# Altium schematic sheet WAVE_RESHAPE.SchDoc
size C; SheetNumber: 1; SheetTotal: 1
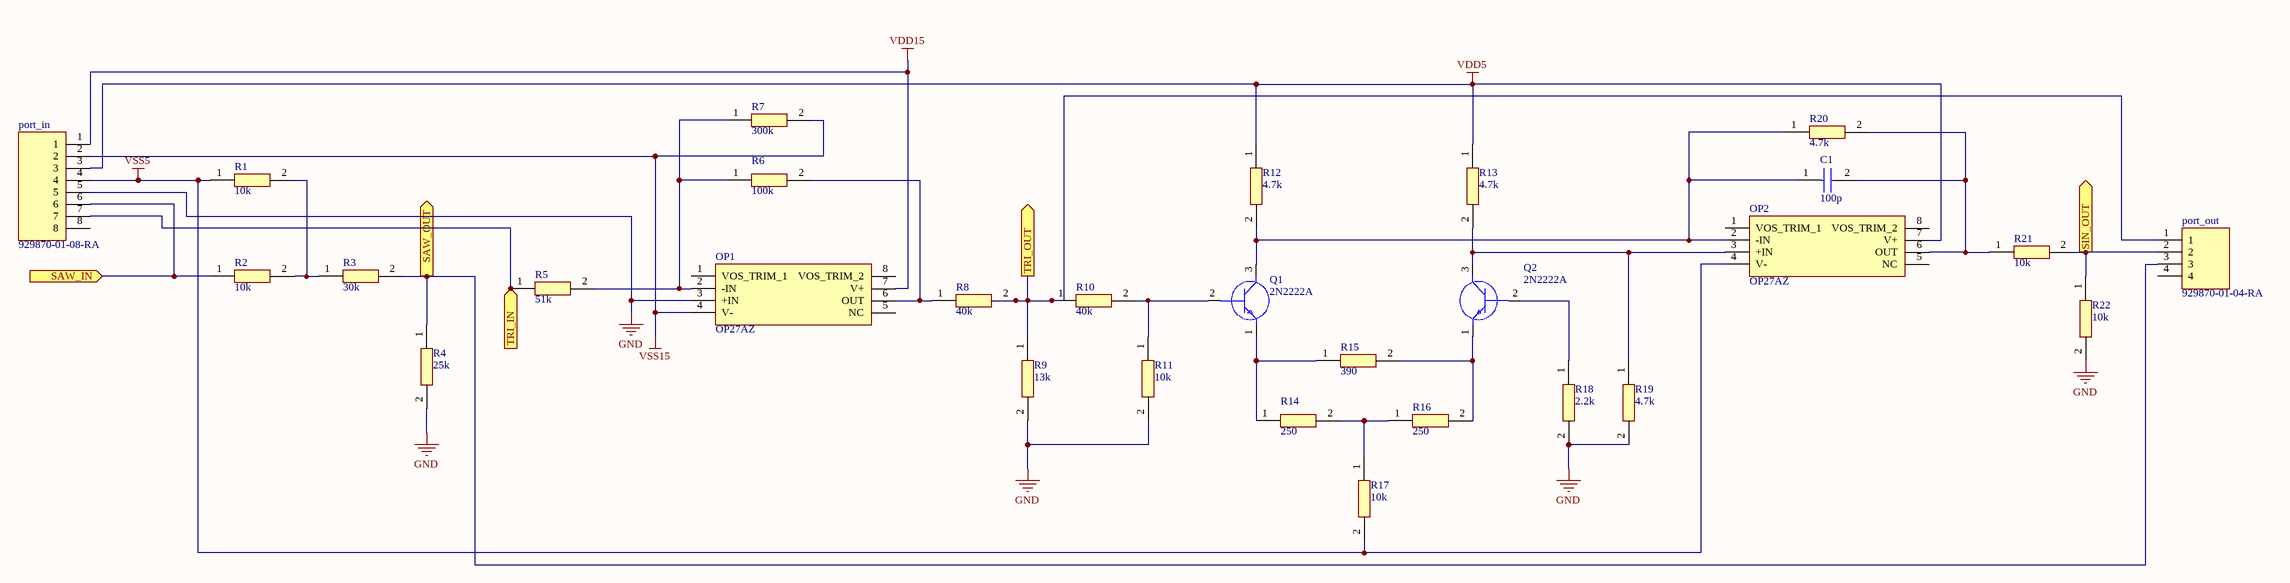
[diagram p0: WAVE_RESHAPE.SchDoc]

## Parts
C1  100p  [CAPPA2400W30L800D400]
OP1  OP27AZ  [DIP775W58P254L1029H508Q8N]
OP2  OP27AZ  [DIP775W58P254L1029H508Q8N]
port_in  929870-01-08-RA  [929870-01-08-RA]
port_out  929870-01-04-RA  [RHDR4W76P0X254_1X4_1016X254X826P]
Q1  2N2222A  [CENTRAL_TO18]
Q2  2N2222A  [CENTRAL_TO18]
R1  10k  [RESAD1650W60L650D250]
R2  10k  [RESAD1650W60L650D250]
R3  30k  [RESAD1650W60L650D250]
R4  25k  [RESAD1650W60L650D250]
R5  51k  [RESAD1650W60L650D250]
R6  100k  [RESAD1650W60L650D250]
R7  300k  [RESAD1650W60L650D250]
R8  40k  [RESAD1650W60L650D250]
R9  13k  [RESAD1650W60L650D250]
R10  40k  [RESAD1650W60L650D250]
R11  10k  [RESAD1650W60L650D250]
R12  4.7k  [RESAD1650W60L650D250]
R13  4.7k  [RESAD1650W60L650D250]
R14  250  [RESAD1650W60L650D250]
R15  390  [RESAD1650W60L650D250]
R16  250  [RESAD1650W60L650D250]
R17  10k  [RESAD1650W60L650D250]
R18  2.2k  [RESAD1650W60L650D250]
R19  4.7k  [RESAD1650W60L650D250]
R20  4.7k  [RESAD1650W60L650D250]
R21  10k  [RESAD1650W60L650D250]
R22  10k  [RESAD1650W60L650D250]

## Ports
SAW_IN (in), SAW_OUT (out), SIN_OUT (out), TRI_IN (in), TRI_OUT (out)

## Nets
GND: OP1.3(+IN) port_in.5 R4.2 R9.2 R11.2 R18.2 R19.2 R22.2
VDD5: OP2.7(V+) port_in.3 R12.1 R13.1
VDD15: OP1.7(V+) port_in.1
VSS5: OP2.4(V-) port_in.4 R1.1 R17.2
VSS15: OP1.4(V-) port_in.2 R7.2
SAW_IN: port_in.6 R2.1 ; port SAW_IN
SAW_OUT: port_out.3 R3.2 R4.1 ; port SAW_OUT
SIN_OUT: port_out.2 R21.2 R22.1 ; port SIN_OUT
TRI_IN: port_in.7 R5.1 ; port TRI_IN
TRI_OUT: port_out.1 R8.2 R9.1 R10.1 ; port TRI_OUT
NetC1_1: C1.1(+) OP2.2(-IN) Q1.3(C) R12.2 R20.1
NetC1_2: C1.2(-) OP2.6(OUT) R20.2 R21.1
NetOP1_2: OP1.2(-IN) R5.2 R6.1 R7.1
NetOP1_6: OP1.6(OUT) R6.2 R8.1
NetOP2_3: OP2.3(+IN) Q2.3(C) R13.2 R19.1
NetQ1_1: Q1.1(E) R14.1 R15.1
NetQ1_2: Q1.2(B) R10.2 R11.1
NetQ2_1: Q2.1(E) R15.2 R16.2
NetQ2_2: Q2.2(B) R18.1
NetR1_2: R1.2 R2.2 R3.1
NetR14_2: R14.2 R16.1 R17.1

Not connected (* = marked no-connect by the designer): OP1 1(VOS_TRIM_1) 5(NC) 8(VOS_TRIM_2); OP2 1(VOS_TRIM_1) 5(NC) 8(VOS_TRIM_2); port_in 8; port_out 4

## Library data of the parts
C1 = 0113207: Capacitor; Manufacturer_Name: RS Pro; Datasheet Link: https://docs.rs-online.com/d68c/0900766b8157e121.pdf; Manufacturer_Part_Number: 0113207
OP1 OP2 = OP27AZ: Integrated Circuit; Manufacturer_Name: Analog Devices; Datasheet Link: https://www.analog.com/media/en/technical-documentation/data-sheets/OP27.pdf; Height: 5.08mm; Manufacturer_Part_Number: OP27AZ; Mouser Part Number: 700-OP27AZNR; Mouser Price/Stock: https://www.mouser.co.uk/ProductDetail/Maxim-Integrated/OP27AZ?qs=7RslVrYcaDTFV9h3XrpsTA%3D%3D; Arrow Part Number: OP27AZ; Arrow Price/Stock: https://www.arrow.com/en/products/op27az/analog-devices
port_in = 929870-01-08-RA: Connector; Manufacturer_Name: 3M; Datasheet Link: https://componentsearchengine.com/Datasheets/2/929870-01-08-RA.pdf; Height: 3.8mm; Manufacturer_Part_Number: 929870-01-08-RA; Mouser Part Number: 517-929870-01-08-RA; Mouser Price/Stock: https://www.mouser.co.uk/ProductDetail/3M-Electronic-Solutions-Division/929870-01-08-RA?qs=neFkstNq%252B6FsuK7vJEiMKg%3D%3D; Arrow Part Number: 929870-01-08-RA; Arrow Price/Stock: https://www.arrow.com/en/products/929870-01-08-ra/3m?utm_currency=USD&region=nac
port_out = 929870-01-04-RA: Connector; Manufacturer_Name: 3M; Datasheet Link: https://componentsearchengine.com/Datasheets/2/929870-01-04-RA.pdf; Height: 8.26mm; Manufacturer_Part_Number: 929870-01-04-RA; Mouser Part Number: 517-929870-01-04-RA; Mouser Price/Stock: https://www.mouser.co.uk/ProductDetail/3M-Electronic-Solutions-Division/929870-01-04-RA?qs=neFkstNq%252B6GPZEKactAgTg%3D%3D; Arrow Part Number: 929870-01-04-RA; Arrow Price/Stock: https://www.arrow.com/en/products/929870-01-04-ra/3m
Q1 Q2 = 2N2222A: Transistor BJT NPN; Manufacturer_Name: Central Semiconductor; Datasheet Link: https://my.centralsemi.com/get_document.php?cmp=1&mergetype=pd&mergepath=pd&pdf_id=2N2221A.PDF; Manufacturer_Part_Number: 2N2222A; Mouser Part Number: 610-2N2222A; Mouser Price/Stock: https://www.mouser.com/Search/Refine.aspx?Keyword=610-2N2222A; Arrow Part Number: 2N2222A; Arrow Price/Stock: https://www.arrow.com/en/products/2n2222a/central-semiconductor?utm_currency=USD&region=nac
R1-R22 = MRS25000C1003FC100: Resistor; Manufacturer_Name: Vishay; Datasheet Link: http://www.vishay.com/docs/28724/mrs16m25.pdf; Manufacturer_Part_Number: MRS25000C1003FC100; Mouser Part Number: 594-MRS25000C1003FC1; Mouser Price/Stock: https://www.mouser.co.uk/ProductDetail/Vishay-BC-Components/MRS25000C1003FC100?qs=H30XFsNYD%2FHyk6mBpuomxg%3D%3D; Arrow Part Number: MRS25000C1003FC100; Arrow Price/Stock: https://www.arrow.com/en/products/mrs25000c1003fc100/vishay?region=nac